# Altium schematic sheet CMOY Pro 1.0.SchDoc
size A
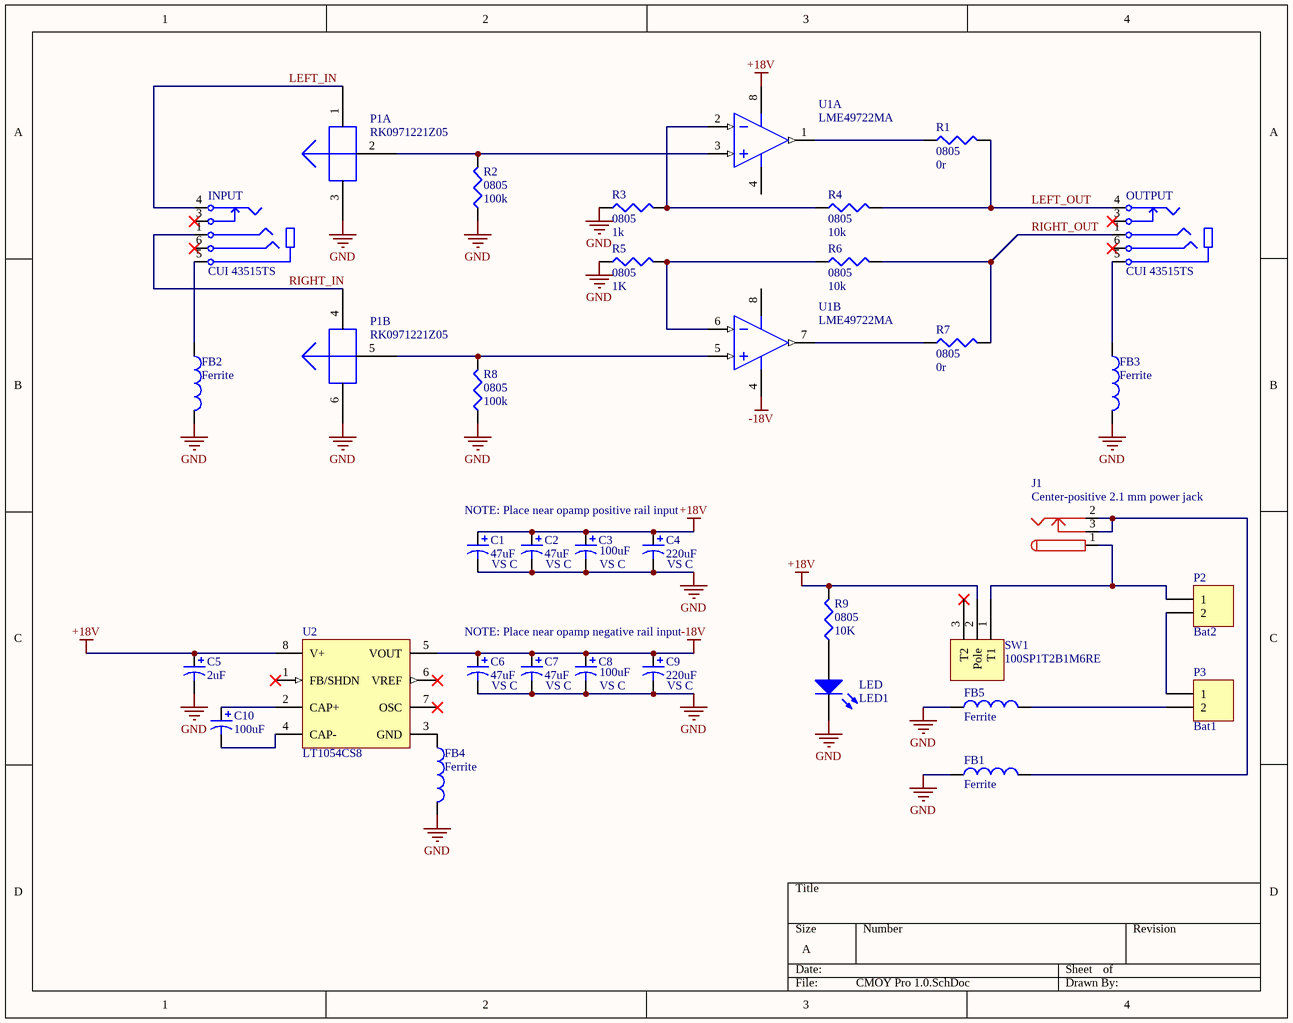
[diagram p0: CMOY Pro 1.0.SchDoc]

## Parts
C1  VS C  value 47uF  [CAPPR2.5-6.3x5]
C2  VS C  value 47uF  [CAPPR2.5-6.3x5]
C3  VS C  value 100uF  [CAPPR2.5-6.3x5]
C4  VS C  value 220uF  [CAPPR2.5-6.3x5]
C5  value 2uF  [Panasonic VS C]  (hidden comment: Cap Pol1)
C6  VS C  value 47uF  [CAPPR2.5-6.3x5]
C7  VS C  value 47uF  [CAPPR2.5-6.3x5]
C8  VS C  value 100uF  [CAPPR2.5-6.3x5]
C9  VS C  value 220uF  [CAPPR2.5-6.3x5]
C10  value 100uF  [Panasonic VS C]  (hidden comment: Cap Pol1)
FB1  Ferrite  [SM 0805 - gap trimmed]
FB2  Ferrite  [SM 0805 - gap trimmed]
FB3  Ferrite  [SM 0805 - gap trimmed]
FB4  Ferrite  [SM 0805 - gap trimmed]
FB5  Ferrite  [SM 0805 - gap trimmed]
INPUT  CUI 43515TS  [CUI SJ-43515TS]
J1  Center-positive 2.1 mm power jack  [PJ-102AH]
LED  LED1  [SM 0805 polarized]
OUTPUT  CUI 43515TS  [CUI SJ-43515TS]
P1  RK0971221Z05  [RK0971221Z05]  (parts A,B of 3)
P2  Bat2  [HDR1X2]
P3  Bat1  [HDR1X2]
R1  0805  value 0r  [SM 0805 - gap trimmed]
R2  0805  value 100k  [SM 0805 - gap trimmed]
R3  0805  value 1k  [SM 0805 - gap trimmed]
R4  0805  value 10k  [SM 0805 - gap trimmed]
R5  0805  value 1K  [SM 0805 - gap trimmed]
R6  0805  value 10k  [SM 0805 - gap trimmed]
R7  0805  value 0r  [SM 0805 - gap trimmed]
R8  0805  value 100k  [SM 0805 - gap trimmed]
R9  0805  value 10K  [SM 0805 - gap trimmed]
SW1  100SP1T2B1M6RE  [100SP1T2B1M6RE]
U1  LME49722MA  [M08A_N]  (parts A,B of 2)
U2  LT1054CS8  [LT-S8-8_N]

## Nets
+18V: C1.1 C2.1 C3.1 C4.1 C5.1 R9.2 SW1.2(Pole) U1.8(V+) U2.8(V+)
-18V: C6.1 C7.1 C8.1 C9.1 U1.4(V-) U2.5(VOUT)
GND: C1.2 C2.2 C3.2 C4.2 C5.2 C6.2 C7.2 C8.2 C9.2 FB1.1 FB2.2 FB3.2 FB4.2 FB5.1 LED.1(A) P1.3 P1.6 R2.1 R3.1 R5.1 R8.1
LEFT_IN: INPUT.4(TIP) P1.1
LEFT_OUT: OUTPUT.4(TIP) R1.2 R4.2
RIGHT_IN: INPUT.1(R1) P1.4
RIGHT_OUT: OUTPUT.1(R1) R6.2 R7.2
NetC10_1: C10.1 U2.2(CAP+)
NetC10_2: C10.2 U2.4(CAP-)
NetFB1_2: FB1.2 J1.2 J1.3
NetFB2_1: FB2.1 INPUT.5(SLEEVE)
NetFB3_1: FB3.1 OUTPUT.5(SLEEVE)
NetFB4_1: FB4.1 U2.3(GND)
NetFB5_2: FB5.2 P3.2
NetJ1_1: J1.1 P2.1 SW1.1(T1)
NetLED_2: LED.2(K) R9.1
NetP1_2: P1.2 R2.2 U1.3(IN_A)
NetP1_5: P1.5 R8.2 U1.5(IN_B)
NetP2_2: P2.2 P3.1
NetR1_1: R1.1 U1.1(OUT_A)
NetR3_2: R3.2 R4.1 U1.2(IN_A)
NetR5_2: R5.2 R6.1 U1.6(IN_B)
NetR7_1: R7.1 U1.7(OUT_B)

Not connected (* = marked no-connect by the designer): INPUT 3(TS)* 6(R2)*; OUTPUT 3(TS)* 6(R2)*; SW1 3(T2)* 4(NC) 5(NC); U2 1(FB/SHDN)* 6(VREF)* 7(OSC)*

## Notes on the sheet
- NOTE: Place near opamp positive rail input
- NOTE: Place near opamp negative rail input

## Library data of the parts
C1-C10 = Cap Pol1: Polarized Capacitor (Radial); Published: 8-Jun-2000; LatestRevisionDate: 17-Jul-2002; LatestRevisionNote: Re-released for DXP Platform.; PackageReference: RB7.6-15; Publisher: Altium Limited; PackageDescription: Polarized Capacitor (Radial); 2 Leads
FB1-FB5 = Inductor: Code_IEC: 1005; Published: 8-Jun-2000; LatestRevisionDate: 17-Jul-2002; LatestRevisionNote: Re-released for DXP Platform.; PackageReference: 0402-A; Publisher: Altium Limited; Code_JEITA: 0402
J1 = PWR2.5: Power jack; Published: 17-Dec-2003; DatasheetDocument: 09-May-2002; Publisher: Altium Limited; ComponentLink1Description: Manufacturer Link; ComponentLink1URL: http://domino.kycon.com/internet/Products.html
LED = LED1: Typical RED GaAs LED; Published: 8-Jun-2000; LatestRevisionDate: 08-Jul-2005; LatestRevisionNote: Mech Layer 1 removed.; PackageReference: LED-1; Publisher: Altium Limited; PackageDescription: LED; 2 Leads
P1 = RK0971221Z05: PCB Mount Dual Ganged 10K Pot
P2 P3 = Header 2: Header, 2-Pin; LatestRevisionDate: 17-Jul-2002; LatestRevisionNote: Re-released for DXP Platform.; Publisher: Altium Limited
R1-R9 = Res3: Resistor; Published: 8-Jun-2000; LatestRevisionDate: 29-May-2009; LatestRevisionNote: IPC-7351 Footprint Added.; PackageReference: J1-0603; Publisher: Altium Limited; PackageDescription: Chip Resistor
SW1 = 100SP1T2B1M6RE: Right angle PCB Mount Toggle Switch
U1 = LME49722MA: Low Noise, High Performance, High Fidelity Dual Audio Operational Amplifier, 8-pin Narrow SOIC; Manufacturer: National Semiconductor; PackageTopMarking: NSZXTT*L49722*MA; PowerWise: N; CompType: Audio IC; High-Reliability: Y; DatasheetVersion: Mar-2008; PackageVersion: revM, May-2009; PackageReference: M08A; PackageDescription: SOIC Narrow, 4.9 x 3.9 x 1.45mm, 8 Lead, 1.27mm Pitch; PartNumber: LME49722MA; RoHS: Y; PinCount: 8; Code_JEDEC: MS-012-AA; Code_IPC: SOIC127P600-8; ComponentLink1Description: Manufacturer URL; ComponentLink1URL: http://www.national.com/; ComponentLink2Description: LME49722 Datasheet; ComponentLink2URL: http://www.national.com/ds/LM/LME49722.pdf; ComponentLink3Description: LME49722 Web Page; ComponentLink3URL: http://www.national.com/pf/LM/LME49722.html; ComponentLink4Description: M08A Package Page; ComponentLink4URL: http://www.national.com/packaging/folders/m08a.html
U2 = LT1054CS8: Switched-Capacitor Voltage Converter with Regulator, 3.5 to 15 V Vin, Adjustable Vout, 8-pin SOIC (S8-8), 0 to 100 degC; Manufacturer: Linear Technology; Frequency(kHz): 25; Ishutdown(uA): 100; Isupply(mA): 2.5; Vin Max(V): 15; Vin Min(V): 3.5; Voutput: Adj; DatasheetVersion: Rev. G; PackageVersion: Rev. G, 03/2012; PackageReference: S8-8; PackageDescription: 8-Pin Plastic Small Outline (Narrow .150 Inch), Body 4.9 x 3.9 mm, Pitch 1.27 mm; Supplier 1: Digi-Key; Supplier Part Number 1: LT1054CS8-ND; Supplier 2: Newark; Supplier Part Number 2: 57M1187; Max Iout(mA): 100; RoHS: FALSE; Mounting Technology: Surface Mount; PartNumber: LT1054CS8; ComponentLink1Description: Manufacturer URL; ComponentLink1URL: http://www.linear.com/; ComponentLink2Description: Datasheet; ComponentLink2URL: http://cds.linear.com/docs/en/datasheet/1054lfg.pdf; ComponentLink3Description: Package Specification; ComponentLink3URL: http://cds.linear.com/docs/en/packaging/05081610_G_SO8.pdf